# EAGLE design Battery_tester (EAGLE 6.5.0)
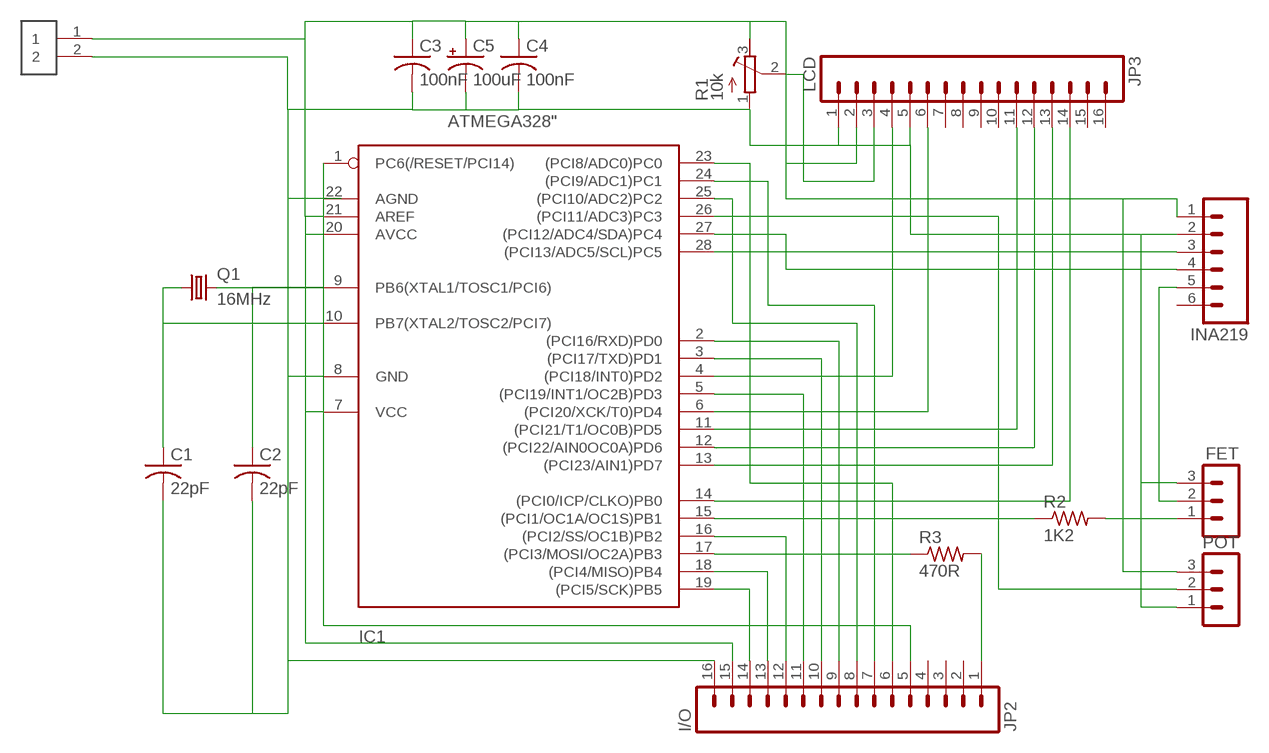
[diagram p0: schematic, sheet 1]

## Parts
C1  22pF  UNPOLARIZED_CAP"  [UNPOLARIZED_CAP]
C2  22pF  UNPOLARIZED_CAP"  [UNPOLARIZED_CAP]
C3  100nF  UNPOLARIZED_CAP"  [UNPOLARIZED_CAP]
C4  100nF  UNPOLARIZED_CAP"  [UNPOLARIZED_CAP]
C5  100uF  ELECTROLYTIC_CAP2.54MM  [ELECTROLYTIC_CAP]
FET  MA03-1  [MA03-1]
I/O  JP2  1X16_HEADER"  [1X16_HEADER]
IC1  ATMEGA328"  [ATMEGA328]
INA219  1X06_HEADER"  [1X06_HEADER]
JP3  LCD  1X16_HEADER"  [1X16_HEADER]
POT  MA03-1  [MA03-1]
Q1  16MHz  CRYSTALHC18U-V  [HC18U-V]
R1  10k  R-TRIMM3339P  [RTRIM3339P]
R2  1K2  RESISTOR1/6WATT  [RESISTOR]
R3  470R  RESISTOR1/6WATT  [RESISTOR]
USB  5V  1X02_HEADER  [1X02_HEADER]

## Nets
N$1: JP3.3 R1.2(S)
N$2: C1.2 C2.2 C3.2 C4.2 C5.- FET.3 I/O.16 IC1.8(GND) INA219.2 JP3.1 JP3.5 POT.1 R1.1(E) USB.2
N$3: C1.1 IC1.10(PB7(XTAL2/TOSC2/PCI7)) Q1.1
N$4: C2.1 IC1.9(PB6(XTAL1/TOSC1/PCI6)) Q1.2
N$5: C3.1 C4.1 C5.+ I/O.15 IC1.7(VCC) IC1.20(AVCC) IC1.21(AREF) INA219.1 JP3.2 POT.3 R1.3(A) USB.1
N$6: IC1.4((PCI18/INT0)PD2) JP3.4
N$7: IC1.6((PCI20/XCK/T0)PD4) JP3.6
N$8: IC1.11((PCI21/T1/OC0B)PD5) JP3.11
N$9: IC1.12((PCI22/AIN0OC0A)PD6) JP3.12
N$10: IC1.13((PCI23/AIN1)PD7) JP3.13
N$11: IC1.14((PCI0/ICP/CLKO)PB0) JP3.14
N$12: IC1.28((PCI13/ADC5/SCL)PC5) INA219.3
N$13: IC1.27((PCI12/ADC4/SDA)PC4) INA219.4
N$14: IC1.15((PCI1/OC1A/OC1S)PB1) R2.1
N$15: FET.1 R2.2
N$16: FET.2 INA219.5
N$17: IC1.26((PCI11/ADC3)PC3) POT.2
N$18: IC1.17((PCI3/MOSI/OC2A)PB3) R3.1
N$19: I/O.1 R3.2
N$20: I/O.14 IC1.19((PCI5/SCK)PB5)
N$21: I/O.13 IC1.18((PCI4/MISO)PB4)
N$22: I/O.12 IC1.16((PCI2/SS/OC1B)PB2)
N$23: I/O.11 IC1.5((PCI19/INT1/OC2B)PD3)
N$24: I/O.10 IC1.3((PCI17/TXD)PD1)
N$25: I/O.9 IC1.2((PCI16/RXD)PD0)
N$26: I/O.8 IC1.25((PCI10/ADC2)PC2)
N$27: I/O.7 IC1.24((PCI9/ADC1)PC1)
N$28: I/O.6 IC1.23((PCI8/ADC0)PC0)
N$29: I/O.5 IC1.1(PC6(/RESET/PCI14))
Unconnected: I/O.2 I/O.3 I/O.4 IC1.22(AGND) INA219.6 JP3.7 JP3.8 JP3.9 JP3.10 JP3.15 JP3.16

## Library data of the parts
C1-C4 = RBBB:UNPOLARIZED_CAP: CAPACITOR, American symbol
C5 = RBBB:ELECTROLYTIC_CAP: POLARIZED CAPACITOR, American symbol
FET POT = con-lstb:MA03-1: PIN HEADER; OC_FARNELL: unknown; OC_NEWARK: unknown
I/O JP3 = RBBB:1X16_HEADER
IC1 = RBBB:ATMEGA328: MICROCONTROLLER 16 kBytes FLASH 1 kBytes SRAM 512 Bytes EEPROM USART 8-channel 10 bit ADC
INA219 = RBBB:1X06_HEADER
Q1 = crystal:CRYSTAL: CRYSTAL; OC_FARNELL: unknown; OC_NEWARK: unknown
R1 = resistor:R-TRIMM: Trimm resistor
R2 R3 = RBBB:RESISTOR: RESISTOR, American symbol
USB = RBBB:1X02_HEADER

## Board
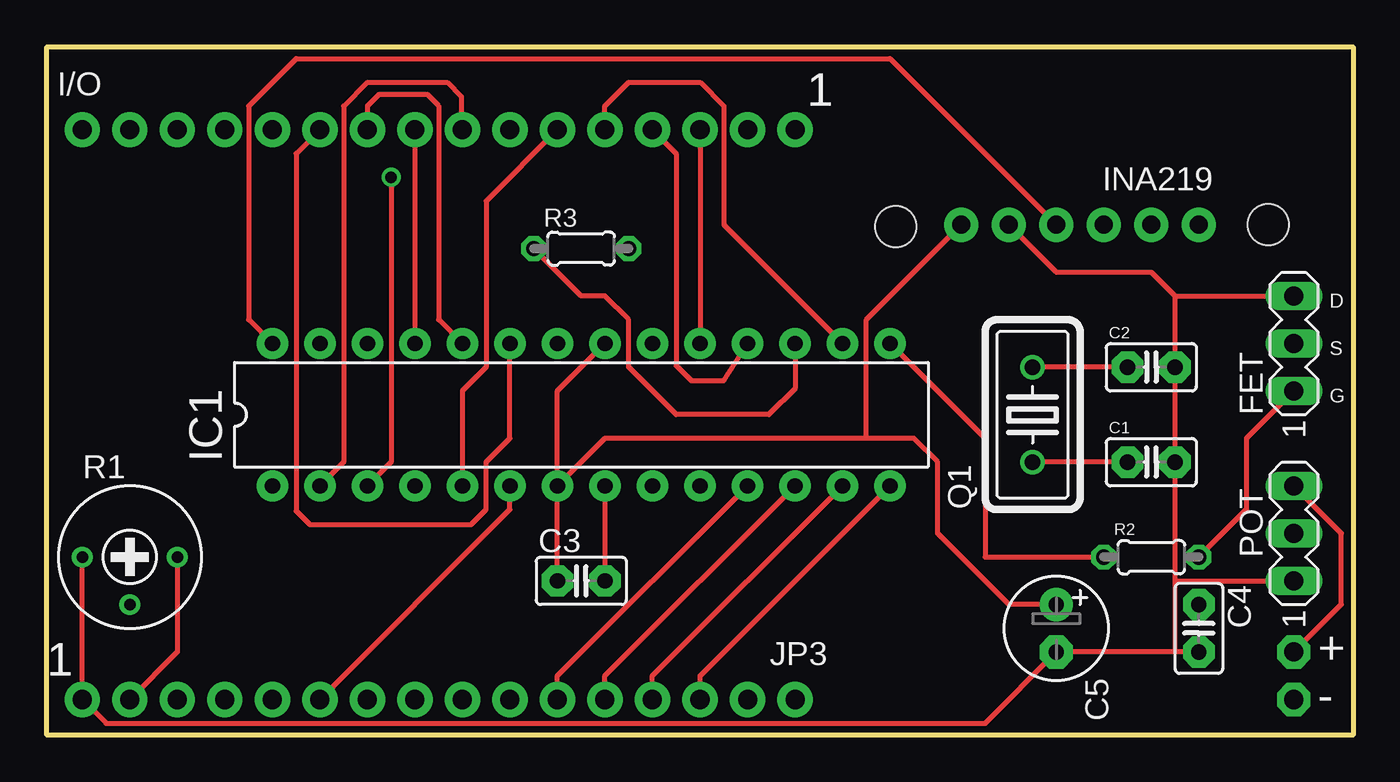
[diagram p1: board, top side]
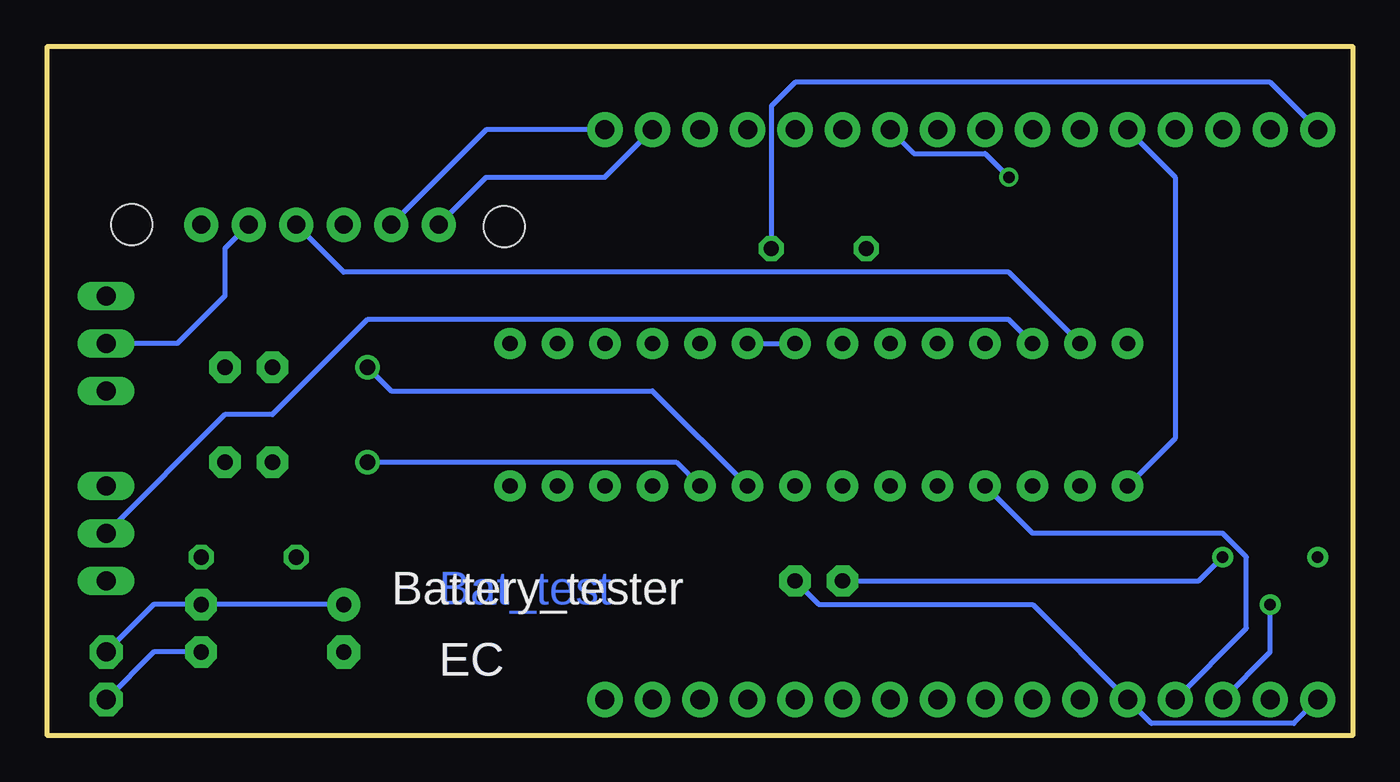
[diagram p2: board, bottom side, seen from below]

Size 69.85 x 36.83 mm. Coordinates in mm from the lower left corner, seen from the top.
Outline: 0,36.83 69.85,36.83 69.85,0 0,0 0,36.83
Copper layers (1*16): Top 0.035mm / dielectric 1.5mm / Bottom 0.035mm
Design rules "default": minimum track width 10mil, minimum drill 24mil, track to track 8mil, track to pad 8mil, pad to pad 8mil, via to via 8mil, smd to smd 8mil, copper to edge 40mil, drill to drill 8mil, minimum pad ring 10mil, minimum via ring 8mil, stop-mask expansion 4mil, vias tented up to drill 0mil, thermal gap 10mil
Holes 2.2 mm at 45.39,27.2 65.3,27.3

### Footprints (pad centres in the part's own frame; a part is rotated, then mirrored left to right if it is on the bottom)
UNPOLARIZED_CAP = drill 0.813 pad 1.676 octagon: 1 -1.27,0; 2 1.27,0
ELECTROLYTIC_CAP = drill 0.813 pad 1.778: + -1.27,0 | drill 0.813 pad 1.778 octagon: - 1.27,0
MA03-1 = drill 1.016 long: 1 -2.54,0; 2 0,0; 3 2.54,0
1X16_HEADER = drill 1.016 pad 1.88: 1 0,0; 2 2.54,0; 3 5.08,0; 4 7.62,0; 5 10.16,0; 6 12.7,0; 7 15.24,0; 8 17.78,0; 9 20.32,0; 10 22.86,0; 11 25.4,0; 12 27.94,0; 13 30.48,0; 14 33.02,0; 15 35.56,0; 16 38.1,0
ATMEGA328 = drill 0.813 pad 1.676: 1 -16.51,-3.81; 2 -13.97,-3.81; 3 -11.43,-3.81; 4 -8.89,-3.81; 5 -6.35,-3.81; 6 -3.81,-3.81; 7 -1.27,-3.81; 8 1.27,-3.81; 9 3.81,-3.81; 10 6.35,-3.81; 11 8.89,-3.81; 12 11.43,-3.81; 13 13.97,-3.81; 14 16.51,-3.81; 15 16.51,3.81; 16 13.97,3.81; 17 11.43,3.81; 18 8.89,3.81; 19 6.35,3.81; 20 3.81,3.81; 21 1.27,3.81; 22 -1.27,3.81; 23 -3.81,3.81; 24 -6.35,3.81; 25 -8.89,3.81; 26 -11.43,3.81; 27 -13.97,3.81; 28 -16.51,3.81
1X06_HEADER = drill 0.965 pad 1.829: 1 0,0; 2 2.54,0; 3 5.08,0; 4 7.62,0; 5 10.16,0; 6 12.7,0
HC18U-V = drill 0.813: 1 -2.54,0; 2 2.54,0
RTRIM3339P = drill 0.61: 1 -2.54,0; 2 0,-2.54; 3 2.54,0
RESISTOR = drill 0.813 octagon: 1 -2.54,0; 2 2.54,0
1X02_HEADER = drill 1.016 pad 1.778 octagon: 1 -1.27,0; 2 1.27,0

### Placement (x,y rotation side)
C1  59.05,14.61 0 top
C2  59.05,19.68 0 top
C3  28.57,8.26 0 top
C4  61.59,5.71 270 top
C5  53.98,5.71 270 top
FET  66.67,20.95 90 top
I/O  1.91,32.39 0 top
IC1  28.57,17.14 0 top
INA219  48.9,27.3 0 top
JP3  1.91,1.91 0 top
POT  66.67,10.79 90 top
Q1  52.71,17.14 90 top
R1  4.45,9.53 0 top
R2  59.05,9.53 0 top
R3  28.57,26.04 0 top
USB  66.67,3.17 270 top

### Tracks (layer width: path | path; a pad name or v marks a point on that pad's centre or on a via)
N$1
  Bottom 0.254: R1.2 4.45,4.45 JP3.3
N$2
  Top 0.254: R1.1 JP3.1 3.17,0.64 50.16,0.64 C5.- 60.33,4.45 | IC1.8 C3.2 | C4.2 60.33,4.45 | INA219.2 53.98,24.76 59.05,24.76 60.33,23.49 | 60.33,23.49 C2.2 C1.2 60.33,8.26 | 60.33,4.45 60.33,8.26 | 60.33,8.26 POT.1 | 60.33,23.49 FET.3
  Bottom 0.254: JP3.1 3.17,0.64 10.79,0.64 JP3.5 17.14,6.99 28.57,6.99 C3.2 | INA219.2 46.36,32.39 I/O.16 | USB.2 64.13,4.45 C4.2
N$3
  Top 0.254: C1.1 Q1.1
  Bottom 0.254: IC1.10 36.2,14.61 Q1.1
N$4
  Top 0.254: C2.1 Q1.2
  Bottom 0.254: IC1.9 37.47,18.41 51.44,18.41 Q1.2
N$5
  Top 0.254: C3.1 IC1.7 | JP3.2 6.99,4.45 R1.3 | IC1.21 27.3,18.41 IC1.7 | C5.+ 51.44,6.99 47.62,10.79 47.62,14.61 46.36,15.88 43.82,15.88 | 43.82,15.88 29.84,15.88 IC1.7 | INA219.1 43.82,22.22 43.82,15.88 | POT.3 69.21,10.79 69.21,6.99 USB.1
  Bottom 0.254: IC1.20 IC1.21 | R1.3 8.26,8.26 C3.1 | USB.1 64.13,6.99 C4.1 C5.+ | I/O.15 40.01,29.84 46.36,29.84 INA219.1
N$6
  Bottom 0.254: IC1.4 17.14,10.79 6.99,10.79 5.71,9.53 5.71,5.71 JP3.4
N$7
  Top 0.254: IC1.6 24.76,12.06 JP3.6
N$8
  Top 0.254: IC1.11 27.3,3.17 JP3.11
N$9
  Top 0.254: IC1.12 29.84,3.17 JP3.12
N$10
  Top 0.254: IC1.13 32.39,3.17 JP3.13
N$11
  Top 0.254: IC1.14 34.93,3.17 JP3.14
N$12
  Top 0.254: IC1.28 10.79,22.22 10.79,33.66 13.34,36.2 45.09,36.2 INA219.3
N$13
  Bottom 0.254: IC1.27 18.41,24.76 53.98,24.76 INA219.4
N$14
  Top 0.254: R2.1 50.16,9.53 50.16,15.88 IC1.15
N$15
  Top 0.254: R2.2 64.13,12.06 64.13,15.88 FET.1
N$16
  Bottom 0.254: INA219.5 60.33,26.04 60.33,23.49 62.87,20.95 FET.2
N$17
  Bottom 0.254: POT.2 60.33,17.14 57.79,17.14 52.71,22.22 18.41,22.22 IC1.26
N$18
  Top 0.254: IC1.17 40.01,18.54 38.61,17.14 33.66,17.14 31.11,19.68 31.11,22.22 29.84,23.49 28.57,23.49 R3.1
N$19
  Bottom 0.254: I/O.1 4.45,34.93 29.84,34.93 31.11,33.66 R3.2
N$20
  Top 0.254: I/O.14 IC1.19
N$21
  Top 0.254: IC1.18 36.2,18.98 36.18,18.96 34.47,18.96 33.66,19.77 33.66,31.11 I/O.13
N$22
  Top 0.254: IC1.16 36.2,27.3 36.2,33.66 34.93,34.93 31.11,34.93 29.84,33.66 I/O.12
N$23
  Top 0.254: IC1.5 22.22,18.41 23.49,19.68 23.49,28.57 I/O.11
N$24  (via drill 0.61)
  Top 0.254: IC1.3 18.41,14.61 v18.41,29.84
  Bottom 0.254: v18.41,29.84 19.68,31.11 23.49,31.11 I/O.10
N$25
  Top 0.254: IC1.2 15.88,14.61 15.88,33.66 17.14,34.93 21.4,34.93 22.16,34.16 22.16,32.45 I/O.9
N$26
  Top 0.254: I/O.8 IC1.25
N$27
  Top 0.254: IC1.24 20.95,22.22 20.95,33.68 20.36,34.27 17.75,34.27 17.14,33.66 I/O.7
N$28
  Top 0.254: IC1.23 24.76,15.88 23.49,14.61 23.49,12.06 22.69,11.27 14.06,11.27 13.34,12 13.34,31.11 I/O.6
N$29
  Bottom 0.254: IC1.1 9.53,15.88 9.53,29.84 I/O.5

### Text on the board
Bottom: Bat_test | EC
tPlace: 1 | D | S | G | 1 | + | -
bPlace: Battery_tester | EC